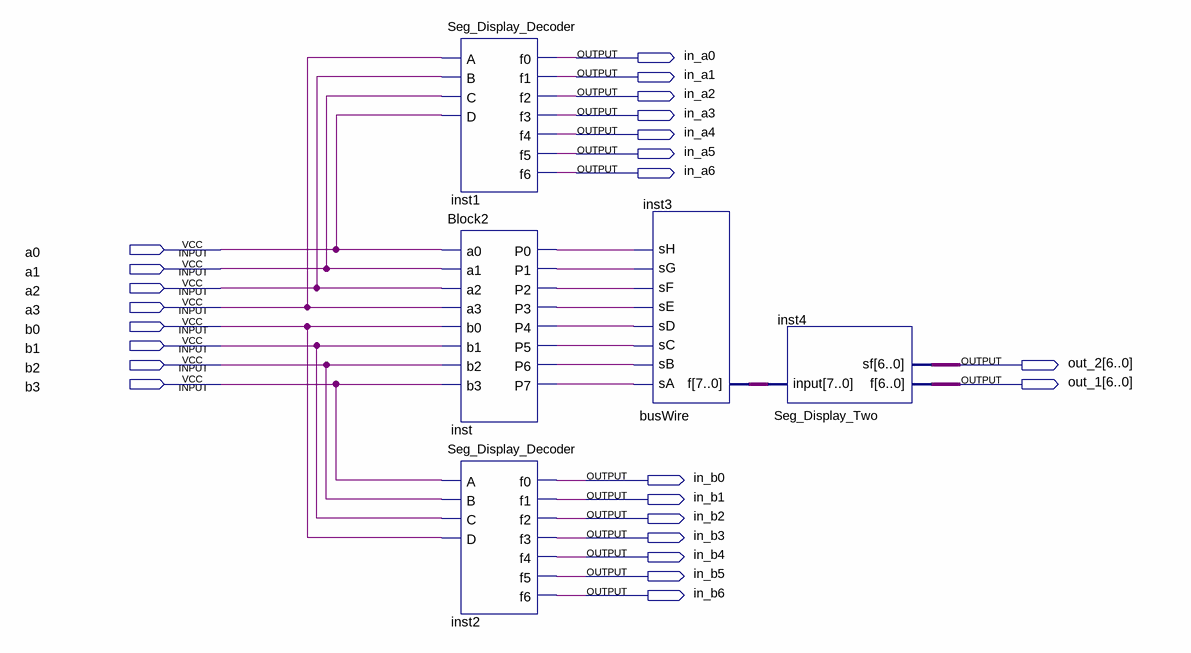
[diagram p0: schematic sheet]
// Quartus schematic Block_Schematic.bdf as structural Verilog: 5 symbols, 24 pins
module Block_Schematic (
  input  a0,
  input  a1,
  input  a2,
  input  a3,
  input  b0,
  input  b1,
  input  b2,
  input  b3,
  output in_a0,
  output in_a1,
  output in_a2,
  output in_a3,
  output in_a4,
  output in_a5,
  output in_a6,
  output [6:0] out_2,
  output [6:0] out_1,
  output in_b0,
  output in_b1,
  output in_b2,
  output in_b3,
  output in_b4,
  output in_b5,
  output in_b6
);

  wire inst_p0, inst_p1, inst_p2, inst_p3, inst_p4, inst_p5, inst_p6, inst_p7;
  wire [7:0] inst3_f;

  Seg_Display_Decoder inst1 (
    .A(a3), .B(a2), .C(a1), .D(a0), .f0(in_a0), .f1(in_a1), .f2(in_a2), .f3(in_a3), .f4(in_a4), .f5(in_a5),
    .f6(in_a6));
  Block2 inst (
    .a0(a0), .a1(a1), .a2(a2), .a3(a3), .b0(b0), .b1(b1), .b2(b2), .b3(b3), .P0(inst_p0), .P1(inst_p1),
    .P2(inst_p2), .P3(inst_p3), .P4(inst_p4), .P5(inst_p5), .P6(inst_p6), .P7(inst_p7));
  Seg_Display_Decoder inst2 (
    .A(b3), .B(b2), .C(b1), .D(b0), .f0(in_b0), .f1(in_b1), .f2(in_b2), .f3(in_b3), .f4(in_b4), .f5(in_b5),
    .f6(in_b6));
  busWire inst3 (
    .sA(inst_p7), .sB(inst_p6), .sC(inst_p5), .sD(inst_p4), .sE(inst_p3), .sF(inst_p2), .sG(inst_p1),
    .sH(inst_p0), .f(inst3_f));
  Seg_Display_Two inst4 (.\input (inst3_f), .f(out_1), .sf(out_2));
endmodule
